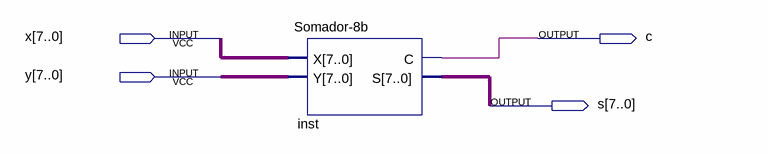
[diagram p0: schematic sheet]
// Quartus schematic Somadorsubtrador.bdf as structural Verilog: 1 symbols, 4 pins
module Somadorsubtrador (
  input  [7:0] x,
  input  [7:0] y,
  output c,
  output [7:0] s
);

  \Somador-8b  inst (.X(x), .Y(y), .C(c), .S(s));
endmodule
